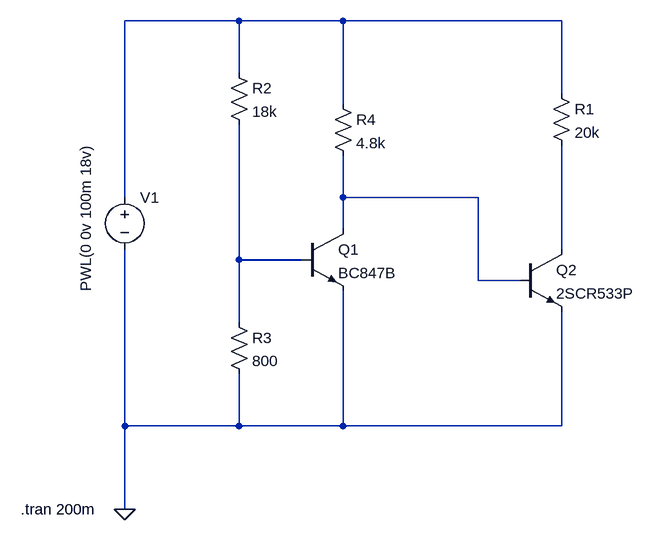
[diagram p0: schematic NPN bjt over voltage protection.asc]
NPN bjt over voltage protection.asc, the LTspice schematic file:
Version 4
SHEET 1 880 680
WIRE -16 -432 -192 -432
WIRE 144 -432 -16 -432
WIRE 480 -432 144 -432
WIRE -16 -352 -16 -432
WIRE 480 -320 480 -432
WIRE 144 -304 144 -432
WIRE -192 -160 -192 -432
WIRE 144 -160 144 -224
WIRE 352 -160 144 -160
WIRE 144 -112 144 -160
WIRE 480 -80 480 -240
WIRE -16 -64 -16 -272
WIRE 80 -64 -16 -64
WIRE 352 -32 352 -160
WIRE 416 -32 352 -32
WIRE -16 32 -16 -64
WIRE -192 192 -192 -80
WIRE -16 192 -16 112
WIRE -16 192 -192 192
WIRE 144 192 144 -16
WIRE 144 192 -16 192
WIRE 480 192 480 16
WIRE 480 192 144 192
WIRE -192 320 -192 192
FLAG -192 320 0
SYMBOL voltage -192 -176 R0
WINDOW 3 -60 -66 VRight 2
WINDOW 123 0 0 Left 0
WINDOW 39 0 0 Left 0
SYMATTR InstName V1
SYMATTR Value PWL(0 0v 100m 18v)
SYMBOL npn 80 -112 R0
SYMATTR InstName Q1
SYMATTR Value BC847B
SYMBOL npn 416 -80 R0
SYMATTR InstName Q2
SYMATTR Value 2SCR533P
SYMBOL res 464 -336 R0
SYMATTR InstName R1
SYMATTR Value 20k
SYMBOL res -32 -368 R0
SYMATTR InstName R2
SYMATTR Value 18k
SYMBOL res -32 16 R0
SYMATTR InstName R3
SYMATTR Value 800
SYMBOL res 128 -320 R0
SYMATTR InstName R4
SYMATTR Value 4.8k
TEXT -352 320 Left 2 !.tran 200m

The netlist it stands for:
* NPN bjt over voltage protection.asc
V1 N001 0 PWL(0 0v 100m 18v)
Q1 N002 N004 0 0 BC847B
Q2 N003 N002 0 0 2SCR533P
R1 N001 N003 20k
R2 N001 N004 18k
R3 N004 0 800
R4 N001 N002 4.8k
.model NPN NPN
.model PNP PNP
.lib standard.bjt
.tran 200m
.backanno
.end